# Altium schematic sheet Display_Unit.SchDoc
size A4; SheetNumber: 2; SheetTotal: 4
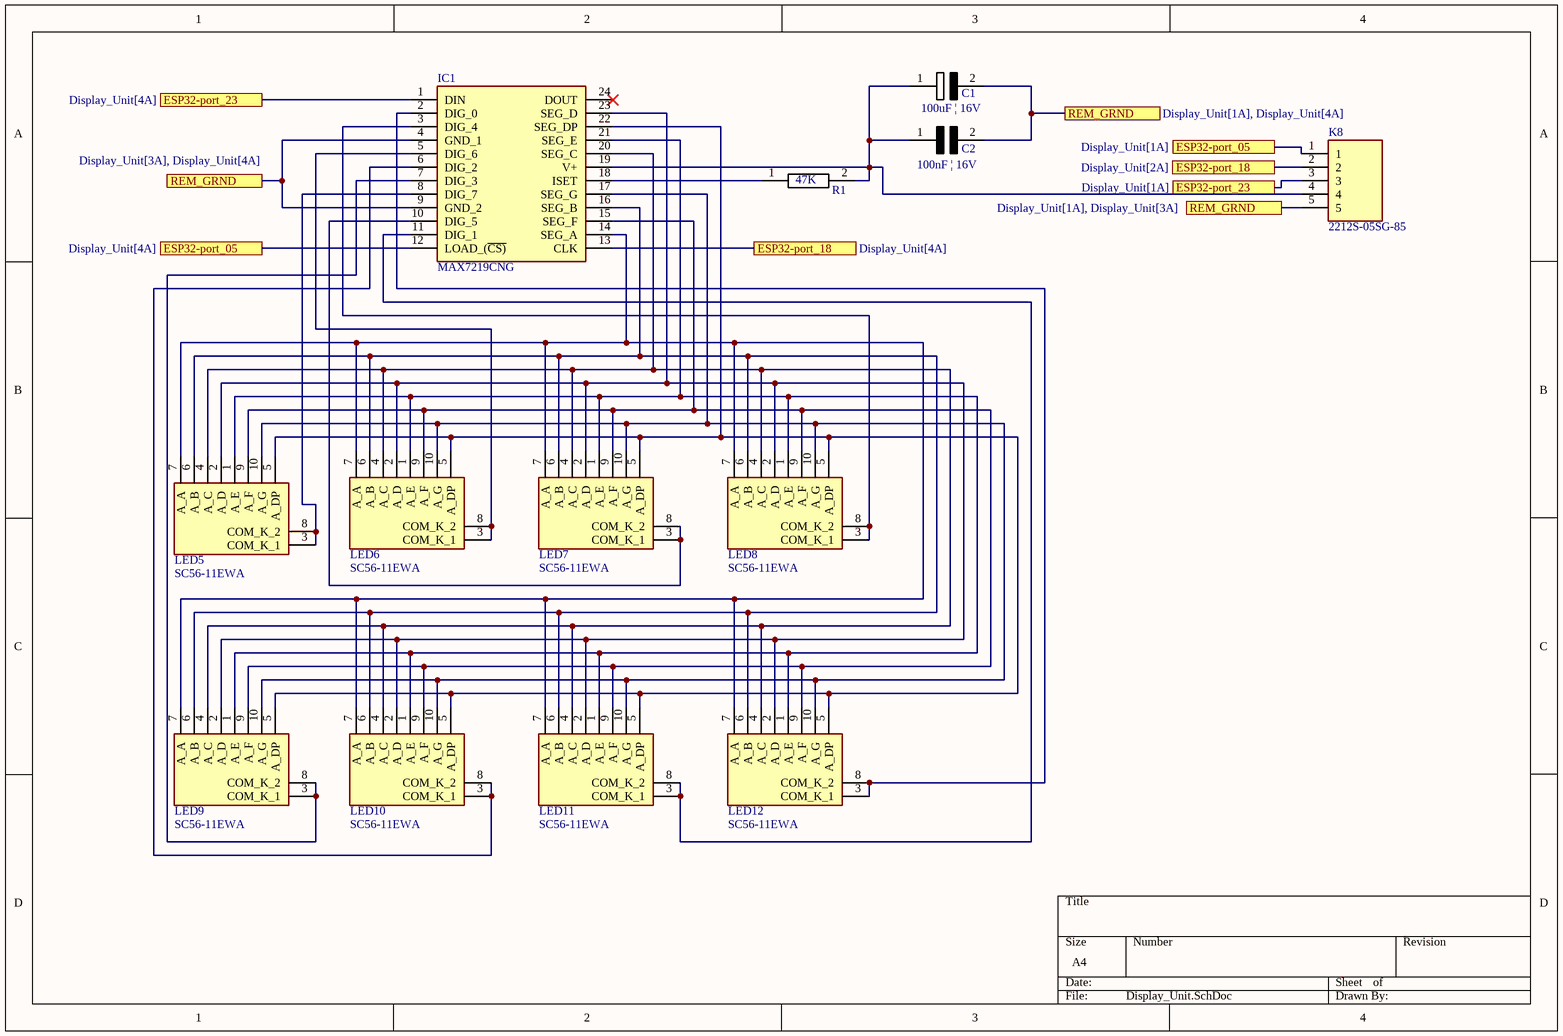
[diagram p0: Display_Unit.SchDoc]

## Parts
C1  100uF | 16V  [C0805]
C2  100nF | 16V  [C0805]
IC1  MAX7219CNG  [DIP794W56P254L3054H457Q24N]
K8  2212S-05SG-85  [RHDR5W74P0X254_1X5_1320X250X850P]
LED5  SC56-11EWA  [DIPS1524W75P254L1270H825Q10N]
LED6  SC56-11EWA  [DIPS1524W75P254L1270H825Q10N]
LED7  SC56-11EWA  [DIPS1524W75P254L1270H825Q10N]
LED8  SC56-11EWA  [DIPS1524W75P254L1270H825Q10N]
LED9  SC56-11EWA  [DIPS1524W75P254L1270H825Q10N]
LED10  SC56-11EWA  [DIPS1524W75P254L1270H825Q10N]
LED11  SC56-11EWA  [DIPS1524W75P254L1270H825Q10N]
LED12  SC56-11EWA  [DIPS1524W75P254L1270H825Q10N]
R1  47K  [C0805]

## Ports
ESP32-port_05 (see Display_Unit[1A]), ESP32-port_05 (see Display_Unit[4A]), ESP32-port_18 (see Display_Unit[2A]), ESP32-port_18 (see Display_Unit[4A]), ESP32-port_23 (see Display_Unit[1A]), ESP32-port_23 (see Display_Unit[4A]), REM_GRND (see Display_Unit[1A], Display_Unit[3A]), REM_GRND (see Display_Unit[1A], Display_Unit[4A]), REM_GRND (see Display_Unit[3A], Display_Unit[4A])

## Nets
ESP32-port_05: IC1.12(LOAD_(~{CS)}) K8.1 ; port ESP32-port_05
ESP32-port_18: IC1.13(CLK) K8.2 ; port ESP32-port_18
ESP32-port_23: IC1.1(DIN) K8.3 ; port ESP32-port_23
REM_GRND: C1.2 C2.2 IC1.4(GND_1) IC1.9(GND_2) K8.5 ; port REM_GRND
NetC1_1: C1.1 C2.1 IC1.19(V+) K8.4 R1.2
NetIC1_2: IC1.2(DIG_0) LED12.3(COM_K_1) LED12.8(COM_K_2)
NetIC1_3: IC1.3(DIG_4) LED8.3(COM_K_1) LED8.8(COM_K_2)
NetIC1_5: IC1.5(DIG_6) LED6.3(COM_K_1) LED6.8(COM_K_2)
NetIC1_6: IC1.6(DIG_2) LED10.3(COM_K_1) LED10.8(COM_K_2)
NetIC1_7: IC1.7(DIG_3) LED9.3(COM_K_1) LED9.8(COM_K_2)
NetIC1_8: IC1.8(DIG_7) LED5.3(COM_K_1) LED5.8(COM_K_2)
NetIC1_10: IC1.10(DIG_5) LED7.3(COM_K_1) LED7.8(COM_K_2)
NetIC1_11: IC1.11(DIG_1) LED11.3(COM_K_1) LED11.8(COM_K_2)
NetIC1_14: IC1.14(SEG_A) LED5.7(A_A) LED6.7(A_A) LED7.7(A_A) LED8.7(A_A) LED9.7(A_A) LED10.7(A_A) LED11.7(A_A) LED12.7(A_A)
NetIC1_15: IC1.15(SEG_F) LED5.9(A_F) LED6.9(A_F) LED7.9(A_F) LED8.9(A_F) LED9.9(A_F) LED10.9(A_F) LED11.9(A_F) LED12.9(A_F)
NetIC1_16: IC1.16(SEG_B) LED5.6(A_B) LED6.6(A_B) LED7.6(A_B) LED8.6(A_B) LED9.6(A_B) LED10.6(A_B) LED11.6(A_B) LED12.6(A_B)
NetIC1_17: IC1.17(SEG_G) LED5.10(A_G) LED6.10(A_G) LED7.10(A_G) LED8.10(A_G) LED9.10(A_G) LED10.10(A_G) LED11.10(A_G) LED12.10(A_G)
NetIC1_18: IC1.18(ISET) R1.1
NetIC1_20: IC1.20(SEG_C) LED5.4(A_C) LED6.4(A_C) LED7.4(A_C) LED8.4(A_C) LED9.4(A_C) LED10.4(A_C) LED11.4(A_C) LED12.4(A_C)
NetIC1_21: IC1.21(SEG_E) LED5.1(A_E) LED6.1(A_E) LED7.1(A_E) LED8.1(A_E) LED9.1(A_E) LED10.1(A_E) LED11.1(A_E) LED12.1(A_E)
NetIC1_22: IC1.22(SEG_DP) LED5.5(A_DP) LED6.5(A_DP) LED7.5(A_DP) LED8.5(A_DP) LED9.5(A_DP) LED10.5(A_DP) LED11.5(A_DP) LED12.5(A_DP)
NetIC1_23: IC1.23(SEG_D) LED5.2(A_D) LED6.2(A_D) LED7.2(A_D) LED8.2(A_D) LED9.2(A_D) LED10.2(A_D) LED11.2(A_D) LED12.2(A_D)

Not connected (* = marked no-connect by the designer): IC1 24(DOUT)*

## Library data of the parts
C1 = elektrolytischeC0805: 0805 ceramic capacitor; Manufacturer_Name: Murata Electronics; Manufacturer_Part_Number: GRM188R71H103KA01D; Datasheet Link: https://datasheet.datasheetarchive.com/originals/distributors/Datasheets_SAMA/ec4f1577dddcc7a13ddad897a28002d3.pdf; Height: 0.9mm; Mouser Part Number: 81-GRM39X103K50D; Mouser Price/Stock: https://www.mouser.co.uk/ProductDetail/Murata-Electronics/GRM188R71H103KA01D?qs=WWniysbtxULrL2ljbViAbw%3D%3D; Arrow Part Number: GRM188R71H103KA01D; Arrow Price/Stock: https://www.arrow.com/en/products/grm188r71h103ka01d/murata-manufacturing?region=europe
C2 = KeramischeC0805_1: 0805 ceramic capacitor; Manufacturer_Name: Murata Electronics; Manufacturer_Part_Number: GRM188R71H103KA01D; Datasheet Link: https://datasheet.datasheetarchive.com/originals/distributors/Datasheets_SAMA/ec4f1577dddcc7a13ddad897a28002d3.pdf; Height: 0.9mm; Mouser Part Number: 81-GRM39X103K50D; Mouser Price/Stock: https://www.mouser.co.uk/ProductDetail/Murata-Electronics/GRM188R71H103KA01D?qs=WWniysbtxULrL2ljbViAbw%3D%3D; Arrow Part Number: GRM188R71H103KA01D; Arrow Price/Stock: https://www.arrow.com/en/products/grm188r71h103ka01d/murata-manufacturing?region=europe
IC1 = MAX7219CNG: Integrated Circuit; Manufacturer_Name: Analog Devices; Datasheet Link: https://datasheets.maximintegrated.com/en/ds/MAX7219-MAX7221.pdf; Height: 4.572mm; Manufacturer_Part_Number: MAX7219CNG; Mouser Part Number: 700-MAX7219CNG-NR; Mouser Price/Stock: https://www.mouser.co.uk/ProductDetail/Maxim-Integrated/MAX7219CNG?qs=p6VZ%252BklCkRToQRlZGegBBA%3D%3D
K8 = 2212S-05SG-85: Connector; Manufacturer_Name: Multicomp Pro; Datasheet Link: https://componentsearchengine.com/Datasheets/2/2212S-05SG-85.pdf; Height: 8.5mm; Manufacturer_Part_Number: 2212S-05SG-85
LED5-LED12 = SC56-11EWA: Display; Manufacturer_Name: Kingbright; Datasheet Link: https://www.kingbrightusa.com/images/catalog/SPEC/SC56-11EWA.pdf; Height: 8.25mm; Manufacturer_Part_Number: SC56-11EWA; Mouser Part Number: 604-SC56-11EWA; Mouser Price/Stock: https://www.mouser.co.uk/ProductDetail/Kingbright/SC56-11EWA?qs=y3UkhjaxUTZA9319us7IBQ%3D%3D
R1 = Resistor0805: Manufacturer_Name: Vishay; Manufacturer_Part_Number: CRCW08050000Z0EAHP; Datasheet Link: https://componentsearchengine.com/Datasheets/1/CRCW08051R00FKEAHP.pdf; Height: 0.6mm; Mouser Part Number: 71-CRCW08050000Z0EAH; Mouser Price/Stock: https://www.mouser.co.uk/ProductDetail/Vishay-Dale/CRCW08050000Z0EAHP?qs=pTGEtN%252BMLlDLrJUqQmN2jA%3D%3D; Arrow Part Number: CRCW08050000Z0EAHP; Arrow Price/Stock: https://www.arrow.com/en/products/crcw08050000z0eahp/vishay?region=nac